# Altium schematic sheet ETH_PHY.SchDoc: ETH PHY
size A3; Author: Silvio Navaretti; CompanyName: ARDUINO; DrawnBy: Silvio Navaretti; Engineer: Silvio Navaretti; Organization: ARDUINO; SheetNumber: 36; SheetTotal: 51; RevAuthor: Silvio Navaretti
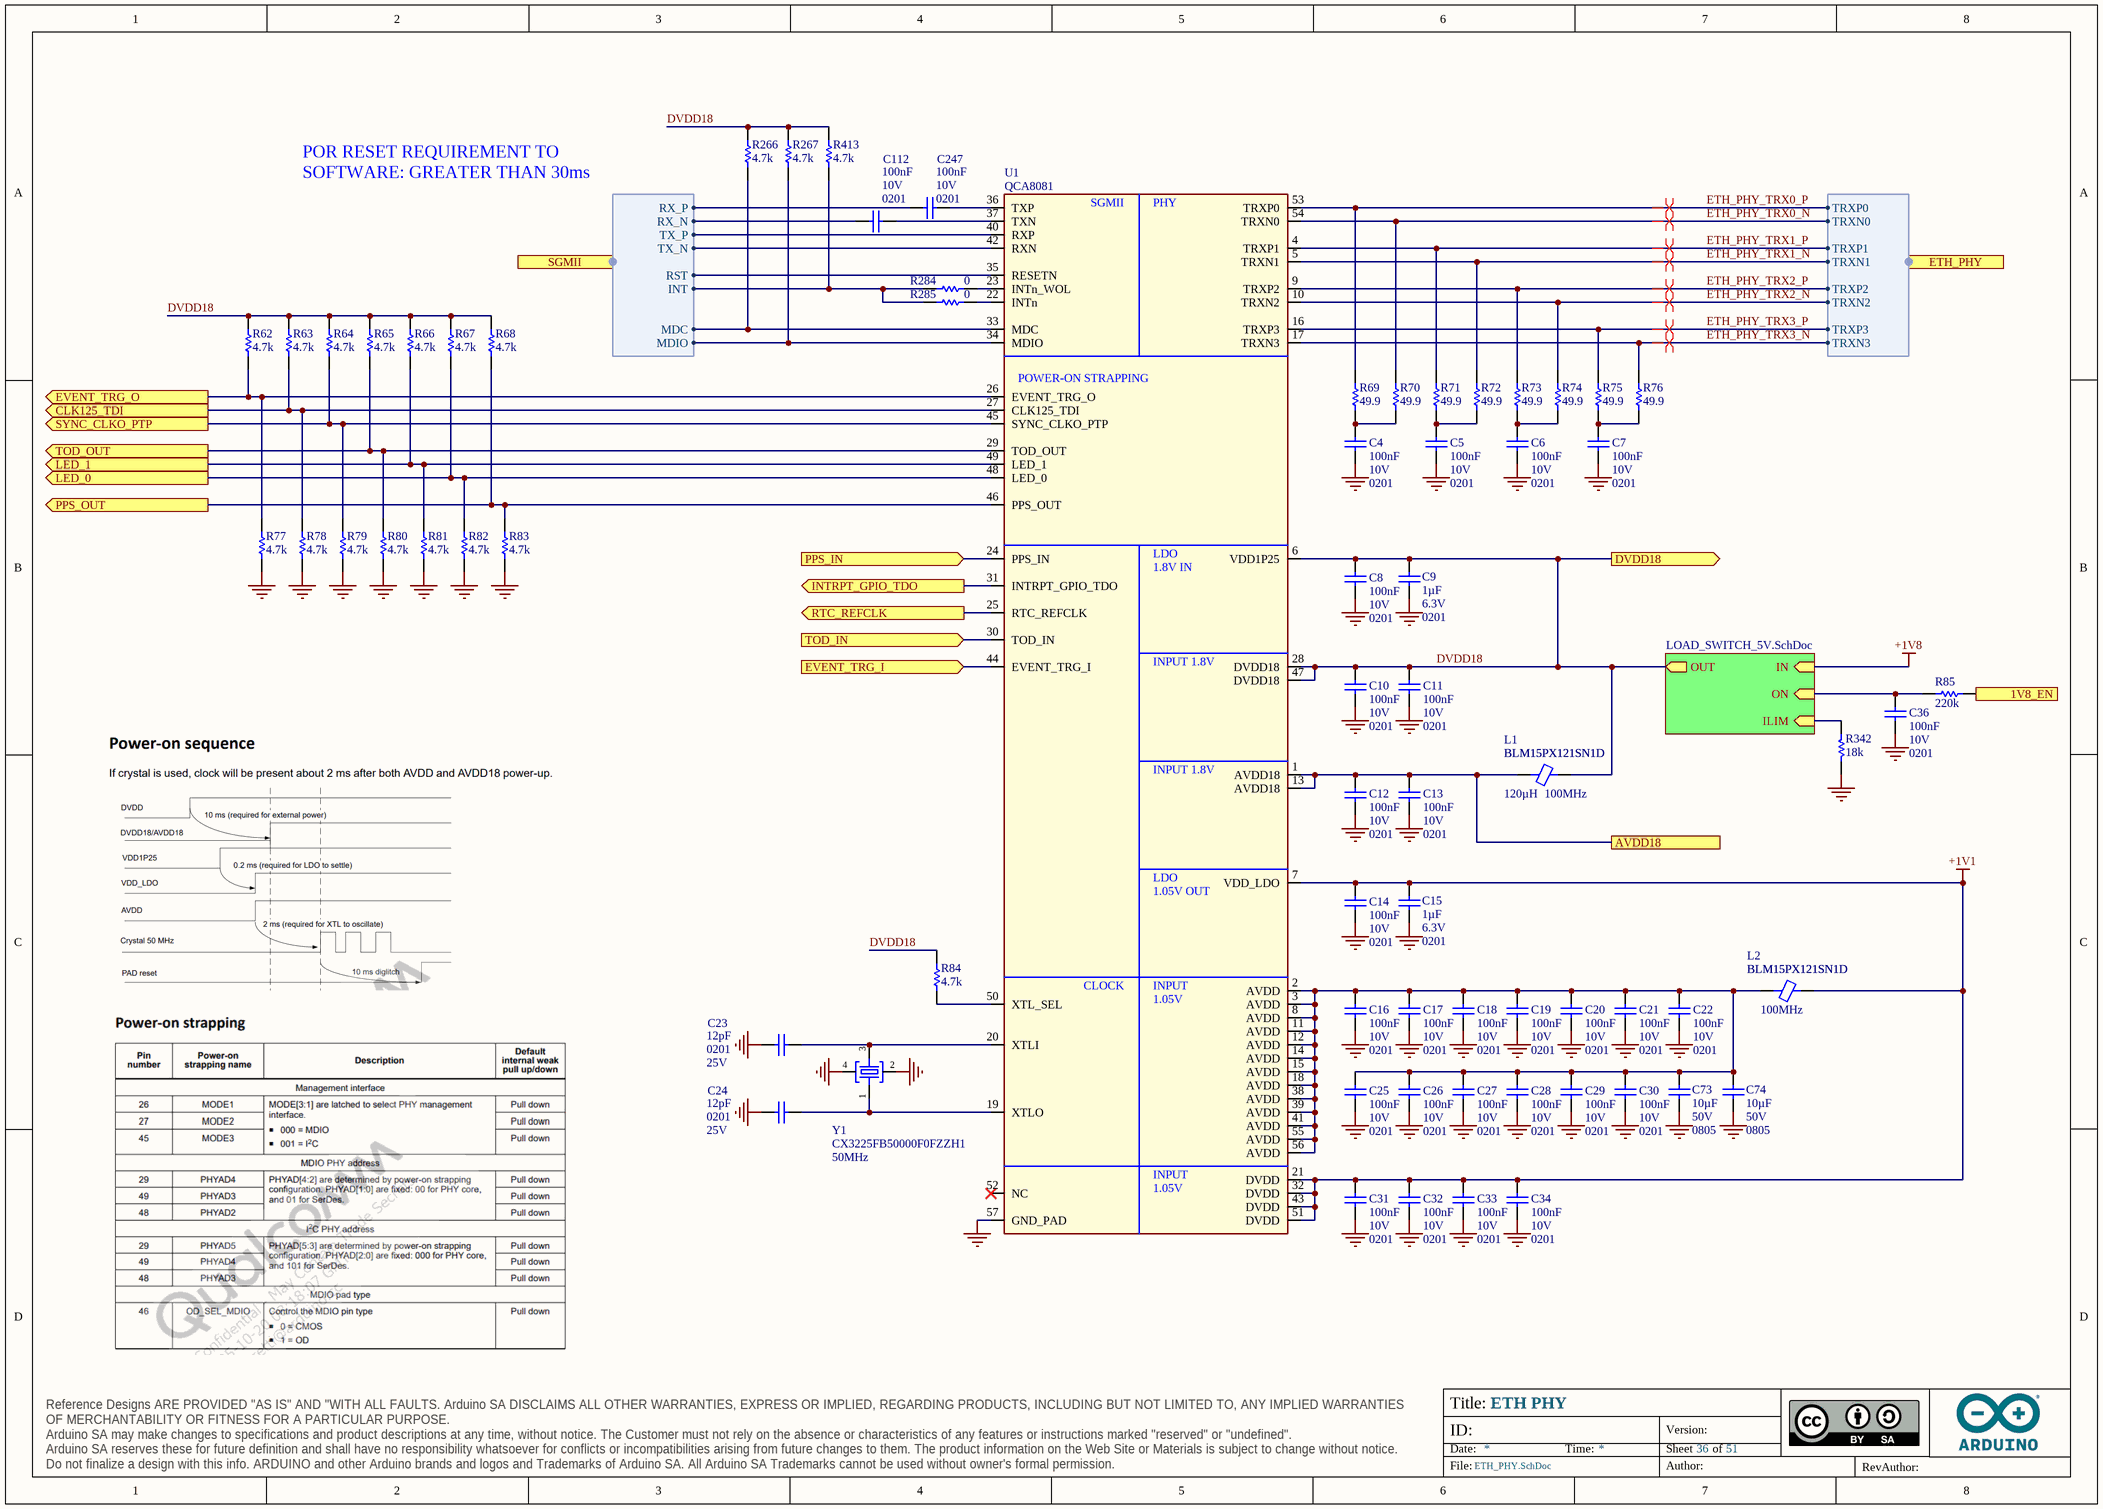
[diagram p0: ETH_PHY.SchDoc]

## Parts
C4  value 100nF  Voltage: 10V  Case Code (Imperial): 0201  [CAP-0201]  (hidden comment: CL03A104KP3NNNC)
C5  value 100nF  Voltage: 10V  Case Code (Imperial): 0201  [CAP-0201]  (hidden comment: CL03A104KP3NNNC)
C6  value 100nF  Voltage: 10V  Case Code (Imperial): 0201  [CAP-0201]  (hidden comment: CL03A104KP3NNNC)
C7  value 100nF  Voltage: 10V  Case Code (Imperial): 0201  [CAP-0201]  (hidden comment: CL03A104KP3NNNC)
C8  value 100nF  Voltage: 10V  Case Code (Imperial): 0201  [CAP-0201]  (hidden comment: CL03A104KP3NNNC)
C9  value 1µF  Voltage: 6.3V  Case Code (Imperial): 0201  [CAP-0201]  (hidden comment: GRM033R60J105MEA2D)
C10  value 100nF  Voltage: 10V  Case Code (Imperial): 0201  [CAP-0201]  (hidden comment: CL03A104KP3NNNC)
C11  value 100nF  Voltage: 10V  Case Code (Imperial): 0201  [CAP-0201]  (hidden comment: CL03A104KP3NNNC)
C12  value 100nF  Voltage: 10V  Case Code (Imperial): 0201  [CAP-0201]  (hidden comment: CL03A104KP3NNNC)
C13  value 100nF  Voltage: 10V  Case Code (Imperial): 0201  [CAP-0201]  (hidden comment: CL03A104KP3NNNC)
C14  value 100nF  Voltage: 10V  Case Code (Imperial): 0201  [CAP-0201]  (hidden comment: CL03A104KP3NNNC)
C15  value 1µF  Voltage: 6.3V  Case Code (Imperial): 0201  [CAP-0201]  (hidden comment: GRM033R60J105MEA2D)
C16  value 100nF  Voltage: 10V  Case Code (Imperial): 0201  [CAP-0201]  (hidden comment: CL03A104KP3NNNC)
C17  value 100nF  Voltage: 10V  Case Code (Imperial): 0201  [CAP-0201]  (hidden comment: CL03A104KP3NNNC)
C18  value 100nF  Voltage: 10V  Case Code (Imperial): 0201  [CAP-0201]  (hidden comment: CL03A104KP3NNNC)
C19  value 100nF  Voltage: 10V  Case Code (Imperial): 0201  [CAP-0201]  (hidden comment: CL03A104KP3NNNC)
C20  value 100nF  Voltage: 10V  Case Code (Imperial): 0201  [CAP-0201]  (hidden comment: CL03A104KP3NNNC)
C21  value 100nF  Voltage: 10V  Case Code (Imperial): 0201  [CAP-0201]  (hidden comment: CL03A104KP3NNNC)
C22  value 100nF  Voltage: 10V  Case Code (Imperial): 0201  [CAP-0201]  (hidden comment: CL03A104KP3NNNC)
C23  value 12pF  Case Code (Imperial): 0201  Voltage: 25V  [CAP-0201]  (hidden comment: GRM0335C1E120JA01J)
C24  value 12pF  Case Code (Imperial): 0201  Voltage: 25V  [CAP-0201]  (hidden comment: GRM0335C1E120JA01J)
C25  value 100nF  Voltage: 10V  Case Code (Imperial): 0201  [CAP-0201]  (hidden comment: CL03A104KP3NNNC)
C26  value 100nF  Voltage: 10V  Case Code (Imperial): 0201  [CAP-0201]  (hidden comment: CL03A104KP3NNNC)
C27  value 100nF  Voltage: 10V  Case Code (Imperial): 0201  [CAP-0201]  (hidden comment: CL03A104KP3NNNC)
C28  value 100nF  Voltage: 10V  Case Code (Imperial): 0201  [CAP-0201]  (hidden comment: CL03A104KP3NNNC)
C29  value 100nF  Voltage: 10V  Case Code (Imperial): 0201  [CAP-0201]  (hidden comment: CL03A104KP3NNNC)
C30  value 100nF  Voltage: 10V  Case Code (Imperial): 0201  [CAP-0201]  (hidden comment: CL03A104KP3NNNC)
C31  value 100nF  Voltage: 10V  Case Code (Imperial): 0201  [CAP-0201]  (hidden comment: CL03A104KP3NNNC)
C32  value 100nF  Voltage: 10V  Case Code (Imperial): 0201  [CAP-0201]  (hidden comment: CL03A104KP3NNNC)
C33  value 100nF  Voltage: 10V  Case Code (Imperial): 0201  [CAP-0201]  (hidden comment: CL03A104KP3NNNC)
C34  value 100nF  Voltage: 10V  Case Code (Imperial): 0201  [CAP-0201]  (hidden comment: CL03A104KP3NNNC)
C36  value 100nF  Voltage: 10V  Case Code (Imperial): 0201  [CAP-0201]  (hidden comment: CL03A104KP3NNNC)
C73  value 10µF  Voltage: 50V  Case Code (Imperial): 0805  [CAP-0805]  (hidden comment: GRM21BR61H106ME43L)
C74  value 10µF  Voltage: 50V  Case Code (Imperial): 0805  [CAP-0805]  (hidden comment: GRM21BR61H106ME43L)
C112  value 100nF  Voltage: 10V  Case Code (Imperial): 0201  [CAP-0201]  (hidden comment: CL03A104KP3NNNC)
C247  value 100nF  Voltage: 10V  Case Code (Imperial): 0201  [CAP-0201]  (hidden comment: CL03A104KP3NNNC)
L1  BLM15PX121SN1D  Inductance: 120µH  Test Frequency: 100MHz  [L-0402]
L2  BLM15PX121SN1D  Test Frequency: 100MHz  [L-0402]
R62  value 4.7k  [RES-0201]  (hidden comment: RC0201FR-074K7L)
R63  value 4.7k  [RES-0201]  (hidden comment: RC0201FR-074K7L)
R64  value 4.7k  [RES-0201]  (hidden comment: RC0201FR-074K7L)
R65  value 4.7k  [RES-0201]  (hidden comment: RC0201FR-074K7L)
R66  value 4.7k  [RES-0201]  (hidden comment: RC0201FR-074K7L)
R67  value 4.7k  [RES-0201]  (hidden comment: RC0201FR-074K7L)
R68  value 4.7k  [RES-0201]  (hidden comment: RC0201FR-074K7L)
R69  value 49.9  [RES-0201]  (hidden comment: AC0201FR-0749R9L)
R70  value 49.9  [RES-0201]  (hidden comment: AC0201FR-0749R9L)
R71  value 49.9  [RES-0201]  (hidden comment: AC0201FR-0749R9L)
R72  value 49.9  [RES-0201]  (hidden comment: AC0201FR-0749R9L)
R73  value 49.9  [RES-0201]  (hidden comment: AC0201FR-0749R9L)
R74  value 49.9  [RES-0201]  (hidden comment: AC0201FR-0749R9L)
R75  value 49.9  [RES-0201]  (hidden comment: AC0201FR-0749R9L)
R76  value 49.9  [RES-0201]  (hidden comment: AC0201FR-0749R9L)
R77  value 4.7k  [RES-0201]  (hidden comment: RC0201FR-074K7L)
R78  value 4.7k  [RES-0201]  (hidden comment: RC0201FR-074K7L)
R79  value 4.7k  [RES-0201]  (hidden comment: RC0201FR-074K7L)
R80  value 4.7k  [RES-0201]  (hidden comment: RC0201FR-074K7L)
R81  value 4.7k  [RES-0201]  (hidden comment: RC0201FR-074K7L)
R82  value 4.7k  [RES-0201]  (hidden comment: RC0201FR-074K7L)
R83  value 4.7k  [RES-0201]  (hidden comment: RC0201FR-074K7L)
R84  value 4.7k  [RES-0201]  (hidden comment: RC0201FR-074K7L)
R85  value 220k  [RES-0201]  (hidden comment: AC0201FR-07220KL)
R266  value 4.7k  [RES-0201]  (hidden comment: RC0201FR-074K7L)
R267  value 4.7k  [RES-0201]  (hidden comment: RC0201FR-074K7L)
R284  value 0  [RES-0201]  (hidden comment: CRCW02010000Z0ED)
R285  value 0  [RES-0201]  (hidden comment: CRCW02010000Z0ED)
R342  value 18k  [RES-0201]  (hidden comment: RC0201FR-0718KL)
R413  value 4.7k  [RES-0201]  (hidden comment: RC0201FR-074K7L)
U1  QCA8081  [Qualcomm QCA8081 56 MQFN 7x7mm pitch 0.4mm]
Y1  CX3225FB50000F0FZZH1  Frequency: 50MHz  [CRYSTAL3.2X2.5]

## Sub-sheets
U_LOAD_SWITCH_5V = LOAD_SWITCH_5V.SchDoc: IN (in), OUT (out), ON (in), ILIM (in)

## Ports
1V8_EN (in), AVDD18, CLK125_TDI (out), DVDD18 (out), ETH_PHY (harness ETH_QCA8081), EVENT_TRG_I (in), EVENT_TRG_O (out), INTRPT_GPIO_TDO (out), LED_0 (out), LED_1 (out), PPS_IN (in), PPS_OUT (out), RTC_REFCLK (out), SGMII (harness SOM_MD_SGMII0), SYNC_CLKO_PTP (out), TOD_IN (in), TOD_OUT (out)

## Harnesses
ETH_QCA8081: TRXP1, TRXN1, TRXP0, TRXN0, TRXP2, TRXN2, TRXP3, TRXN3
SOM_MD_SGMII0: RX_P, RX_N, TX_P, TX_N, RST, MDC, INT, MDIO

## Nets
+1V1: C14.2 C15.2 C31.2 C32.2 C33.2 C34.2 L2.2 U1.7(VDD_LDO) U1.21(DVDD) U1.32(DVDD) U1.43(DVDD) U1.51(DVDD)
+1V8: sheet U_LOAD_SWITCH_5V/IN
GND: C4.1 C5.1 C6.1 C7.1 C8.1 C9.1 C10.1 C11.1 C12.1 C13.1 C14.1 C15.1 C16.1 C17.1 C18.1 C19.1 C20.1 C21.1 C22.1 C23.2 C24.2 C25.1 C26.1 C27.1 C28.1 C29.1 C30.1 C31.1 C32.1 C33.1 C34.1 C36.1 C73.2 C74.2 R77.1 R78.1 R79.1 R80.1 R81.1 R82.1 R83.1 R342.1 U1.57(GND_PAD) Y1.2 Y1.4
1V8_EN: R85.1 ; port 1V8_EN
AVDD18: C12.2 C13.2 L1.1 U1.1(AVDD18) U1.13(AVDD18) ; port AVDD18
CLK125_TDI: R63.1 R78.2 U1.27(CLK125_TDI) ; port CLK125_TDI
DVDD18: C8.2 C9.2 C10.2 C11.2 L1.2 R62.2 R63.2 R64.2 R65.2 R66.2 R67.2 R68.2 R84.2 R266.2 R267.2 R413.2 U1.6(VDD1P25) U1.28(DVDD18) U1.47(DVDD18) ; port DVDD18, sheet U_LOAD_SWITCH_5V/OUT
ETH_PHY_TRX0_N: R70.2 U1.54(TRXN0) ; port ETH_PHY.TRXN0
ETH_PHY_TRX0_P: R69.2 U1.53(TRXP0) ; port ETH_PHY.TRXP0
ETH_PHY_TRX1_N: R72.2 U1.5(TRXN1) ; port ETH_PHY.TRXN1
ETH_PHY_TRX1_P: R71.2 U1.4(TRXP1) ; port ETH_PHY.TRXP1
ETH_PHY_TRX2_N: R74.2 U1.10(TRXN2) ; port ETH_PHY.TRXN2
ETH_PHY_TRX2_P: R73.2 U1.9(TRXP2) ; port ETH_PHY.TRXP2
ETH_PHY_TRX3_N: R76.2 U1.17(TRXN3) ; port ETH_PHY.TRXN3
ETH_PHY_TRX3_P: R75.2 U1.16(TRXP3) ; port ETH_PHY.TRXP3
EVENT_TRG_I: U1.44(EVENT_TRG_I) ; port EVENT_TRG_I
EVENT_TRG_O: R62.1 R77.2 U1.26(EVENT_TRG_O) ; port EVENT_TRG_O
INTRPT_GPIO_TDO: U1.31(INTRPT_GPIO_TDO) ; port INTRPT_GPIO_TDO
LED_0: R67.1 R82.2 U1.48(LED_0) ; port LED_0
LED_1: R66.1 R81.2 U1.49(LED_1) ; port LED_1
PPS_IN: U1.24(PPS_IN) ; port PPS_IN
PPS_OUT: R68.1 R83.2 U1.46(PPS_OUT) ; port PPS_OUT
RTC_REFCLK: U1.25(RTC_REFCLK) ; port RTC_REFCLK
SYNC_CLKO_PTP: R64.1 R79.2 U1.45(SYNC_CLKO_PTP) ; port SYNC_CLKO_PTP
TOD_IN: U1.30(TOD_IN) ; port TOD_IN
TOD_OUT: R65.1 R80.2 U1.29(TOD_OUT) ; port TOD_OUT
NetC4_2: C4.2 R69.1 R70.1
NetC5_2: C5.2 R71.1 R72.1
NetC6_2: C6.2 R73.1 R74.1
NetC7_2: C7.2 R75.1 R76.1
NetC16_2: C16.2 C17.2 C18.2 C19.2 C20.2 C21.2 C22.2 C25.2 C26.2 C27.2 C28.2 C29.2 C30.2 C73.1 C74.1 L2.1 U1.2(AVDD) U1.3(AVDD) U1.8(AVDD) U1.11(AVDD) U1.12(AVDD) U1.14(AVDD) U1.15(AVDD) U1.18(AVDD) U1.38(AVDD) U1.39(AVDD) U1.41(AVDD) U1.55(AVDD) U1.56(AVDD)
NetC23_1: C23.1 U1.20(XTLI) Y1.3
NetC24_1: C24.1 U1.19(XTLO) Y1.1
NetC36_2: C36.2 R85.2 ; sheet U_LOAD_SWITCH_5V/ON
NetC112_1: C112.1 U1.37(TXN)
NetC112_2: C112.2 ; port SGMII.RX_N
NetC247_1: C247.1 U1.36(TXP)
NetC247_2: C247.2 ; port SGMII.RX_P
NetR84_1: R84.1 U1.50(XTL_SEL)
NetR266_1: R266.1 U1.33(MDC) ; port SGMII.MDC
NetR267_1: R267.1 U1.34(MDIO) ; port SGMII.MDIO
NetR284_1: R284.1 R285.1 R413.1 ; port SGMII.INT
NetR284_2: R284.2 U1.23(INTn_WOL)
NetR285_2: R285.2 U1.22(INTn)
NetR342_2: R342.2 ; sheet U_LOAD_SWITCH_5V/ILIM
NetU1_35: U1.35(RESETN) ; port SGMII.RST
NetU1_40: U1.40(RXP) ; port SGMII.TX_P
NetU1_42: U1.42(RXN) ; port SGMII.TX_N

Not connected (* = marked no-connect by the designer): U1 52(NC)*

## Layout directives
differential pair; differential pair class DIFF_ETHPHY; net class DIFF_ETHPHY: ETH_PHY_TRX0_N, ETH_PHY_TRX0_P, ETH_PHY_TRX1_N, ETH_PHY_TRX1_P, ETH_PHY_TRX2_N, ETH_PHY_TRX2_P, ETH_PHY_TRX3_N, ETH_PHY_TRX3_P

## Notes on the sheet
- POR RESET REQUIREMENT TO SOFTWARE: GREATER THAN 30ms
- Title:
- ID:
- Date:
- Time:
- Version:
- Sheet
- of
- RevAuthor:
- Reference Designs ARE PROVIDED "AS IS" AND "WITH ALL FAULTS. Arduino SA DISCLAIMS ALL OTHER WARRANTIES, EXPRESS OR IMPLIED, REGARDING PRODUCTS, INCLUDING BUT NOT LIMITED TO, ANY IMPLIED WARRANTIES OF MERCHANTABILITY OR FITNESS FOR A PARTICULAR PURPOSE.
  Arduino SA may make changes to specifications and product descriptions at any time, without notice. The Customer must not rely on the absence or characteristics of any features or instructions marked "reserved" or "undefined".
  Arduino SA reserves these for future definition and shall have no responsibility whatsoever for conflicts or incompatibilities arising from future changes to them. The product information on the Web Site or Materials is subject to change without notice.
  Do not finalize a design with this info. ARDUINO and other Arduino brands and logos and Trademarks of Arduino SA. All Arduino SA Trademarks cannot be used without owner's formal permission.
- File:
- Author:
- (in symbol U0492-A.6) SGMII; PHY; POWER-ON STRAPPING; LDO / 1.8V IN; INPUT 1.8V; LDO / 1.05V OUT; CLOCK; INPUT 1.05V

## Library data of the parts
C4-C8 C10-C14 C16-C22 C25-C34 C36 C112 C247 = C0113-A.6: CAP CHIP 0201 100nF 10% 10V X5R; Manufacturer: Samsung Electro-Mechanics; Code Arduino: C0113; Technology: Ceramic; Part Number: CL03A104KP3NNNC; Dielectric: X5R; Tolerance: 10%
C9 C15 = C0002-A.15: CAP CHIP 0201 1uF 20% 6.3V X5R; Manufacturer: Murata; Code Arduino: A5520; Tolerance: 20%; Dielectric: X5R; Part Number: GRM033R60J105MEA2D; Technology: Ceramic
C23 C24 = C0003-A.15: CAP CHIP 0201 12pF 5% 25V C0G; Manufacturer: Murata; Code Arduino: C0003; Technology: Ceramic; Part Number: GRM0335C1E120JA01J; Tolerance: 5%; Dielectric: C0G
C73 C74 = C0158-A.3: CAP CHIP 0805 10uF 20% 50V X5R; Manufacturer: Murata Electronics; Code Arduino: C0158; Technology: SMD; Dielectric: X5R; Tolerance: 20%; Part Number: GRM21BR61H106ME43L
L1 = I0028-A.10: FERRITE SMD 0402 120Ohm 25% 100MHz Ferrite 2A; Manufacturer: Murata; DC Resistance (DCR): 55mR; Code Arduino: I0028; Value: 120µH; Part Number: BLM15PX121SN1D; Device Type: Ferrite; Packaging: Tape and Reel; Case Code (Imperial): 0402; Max DC Current: 2A; Case Code (Metric): 1005; Package Quantity: 10000; Current: 2A; Max Operating Temperature: 125°C; Tolerance: 25%; Min Operating Temperature: -55°C
L2 = I0028-A.10: FERRITE SMD 0402 120Ohm 25% 100MHz Ferrite 2A; Manufacturer: Murata; Inductance: 120µH; DC Resistance (DCR): 55mR; Code Arduino: I0028; Value: 120µH; Part Number: BLM15PX121SN1D; Device Type: Ferrite; Packaging: Tape and Reel; Case Code (Imperial): 0402; Max DC Current: 2A; Case Code (Metric): 1005; Package Quantity: 10000; Current: 2A; Max Operating Temperature: 125°C; Tolerance: 25%; Min Operating Temperature: -55°C
R62-R68 R77-R84 R266 R267 R413 = R0151-A.21: RES CHIP 0201 4k7 1% 1/20W; Manufacturer: Yageo; Temperature coefficient: 200ppm; Power: 50mW; Code Arduino: A5521; Technology: Thick film; Case Code (Imperial): 0201; Part Number: RC0201FR-074K7L; Tolerance: 1%
R69-R76 = R0152-A.22: RES CHIP 0201 49R9 1% 1/20W; Manufacturer: Yageo; Temperature coefficient: 200ppm; Power: 50mW; Code Arduino: R0152; Technology: Thick film; Tolerance: 1%; Part Number: AC0201FR-0749R9L; Case Code (Imperial): 0201
R85 = R0199-A.20: RES CHIP 0201 220k 1% 1/20W; Manufacturer: Yageo; Temperature coefficient: 200ppm; Power: 50mW; Code Arduino: R0199; Part Number: AC0201FR-07220KL; Tolerance: 1%; Case Code (Imperial): 0201; Technology: Thick film
R284 R285 = R0140-A.21: RES CHIP 0201 0R; Manufacturer: Vishay; Temperature coefficient: 0ppm; Code Arduino: R0140; Power: 50mW; Tolerance: 0%; Technology: Thick film; Case Code (Imperial): 0201; Part Number: CRCW02010000Z0ED
R342 = R0399-A.1: RES CHIP 0201 18k 1% 1/20W; Manufacturer: YAGEO; Power: 50mW; Code Arduino: R0399; Temperature Coefficient: 200ppm; Technology: Thick film; Tolerance: 1%; Case Code (Imperial): 0201; Part Number: RC0201FR-0718KL
U1 = U0492-A.6: IC ETH PHY 2.5Gb, 7x7mm MQFN56; Manufacturer: Qualcomm; Code Arduino: U0492; Part Number: QCA8081
Y1 = X0031-A.3: CRYSTAL 50MHz tolerance 10ppm stability 20ppm load 10pF 3.2x2.5mm; Manufacturer: Kyocera; Code Arduino: X0031; Series Resistance: 22R; Frequency Tolerance: 10ppm; Load Capacitance: 10pF; Frequency Stability: 20ppm; Max Operating Temperature: 105°C; Part Number: CX3225FB50000F0FZZH1; Min Operating Temperature: -40°C